# Altium schematic sheet INPUTS_OUTPUTS.SchDoc
size A4; SheetNumber: 2; SheetTotal: 4
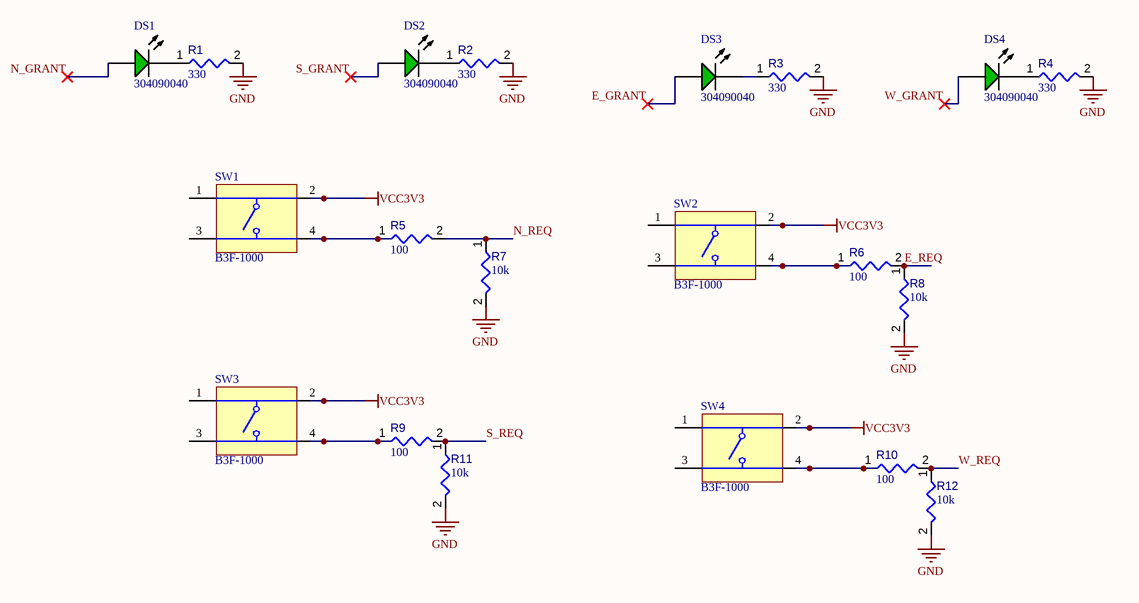
[diagram p0: INPUTS_OUTPUTS.SchDoc]

## Parts
DS1  304090040  [LED-2P-2.28-3MM]
DS2  304090040  [LED-2P-2.28-3MM]
DS3  304090040  [LED-2P-2.28-3MM]
DS4  304090040  [LED-2P-2.28-3MM]
R1  value 330  [RESC0402(1005)_L]  (hidden comment: Resistor 330R +/-5 % 0402 63 mW)
R2  value 330  [RESC0402(1005)_L]  (hidden comment: Resistor 330R +/-5 % 0402 63 mW)
R3  value 330  [RESC0402(1005)_L]  (hidden comment: Resistor 330R +/-5 % 0402 63 mW)
R4  value 330  [RESC0402(1005)_L]  (hidden comment: Resistor 330R +/-5 % 0402 63 mW)
R5  value 100  [RESC0402(1005)_L]  (hidden comment: 100R2F)
R6  value 100  [RESC0402(1005)_L]  (hidden comment: 100R2F)
R7  value 10k  [RESC0402(1005)_L]  (hidden comment: 10KR2F)
R8  value 10k  [RESC0402(1005)_L]  (hidden comment: 10KR2F)
R9  value 100  [RESC0402(1005)_L]  (hidden comment: 100R2F)
R10  value 100  [RESC0402(1005)_L]  (hidden comment: 100R2F)
R11  value 10k  [RESC0402(1005)_L]  (hidden comment: 10KR2F)
R12  value 10k  [RESC0402(1005)_L]  (hidden comment: 10KR2F)
SW1  B3F-1000  [OMRON-B3F-1000-4_V]
SW2  B3F-1000  [OMRON-B3F-1000-4_V]
SW3  B3F-1000  [OMRON-B3F-1000-4_V]
SW4  B3F-1000  [OMRON-B3F-1000-4_V]

## Nets
GND: R1.2 R2.2 R3.2 R4.2 R7.2 R8.2 R11.2 R12.2
VCC3V3: SW1.2 SW2.2 SW3.2 SW4.2
E_GRANT: DS3.1(A)
E_REQ: R6.2 R8.1
N_GRANT: DS1.1(A)
N_REQ: R5.2 R7.1
S_GRANT: DS2.1(A)
S_REQ: R9.2 R11.1
W_GRANT: DS4.1(A)
W_REQ: R10.2 R12.1
NetDS1_2: DS1.2(K) R1.1
NetDS2_2: DS2.2(K) R2.1
NetDS3_2: DS3.2(K) R3.1
NetDS4_2: DS4.2(K) R4.1
NetR5_1: R5.1 SW1.4
NetR6_1: R6.1 SW2.4
NetR9_1: R9.1 SW3.4
NetR10_1: R10.1 SW4.4

Not connected (* = marked no-connect by the designer): SW1 1 3; SW2 1 3; SW3 1 3; SW4 1 3

## Library data of the parts
DS1-DS4 = CMP-007-00006-2: Green LED, 80 mW, 20 mA, -25 to 85 degC, 2-Pin THD; Manufacturer: Shenzhen CGX; Manufacturer URL: http://szcgx.com/; Package Reference: 304090040; Datasheet Version: Rev. 1.0, 09/2014; RoHS Compliant: Unknown; Case/Package: 304090040; Package Description: 2-Pin Through Hole Device, Dia 3 mm, Pitch 2.28 mm; Datasheet URL: http://datasheet.octopart.com/304090040-Chengguangxing-datasheet-62330655.pdf; Mounting Technology: TH
R1-R4 = CMP-009-00132-3: Chip Resistor, 330 Ohms, +/-5 %, 63 mW, -55 to 155 degC, 0402; Power: 63mW; Tolerance: 5%; Pins: 2; Max Operating Temperature: 155°C; Min Operating Temperature: -55°C; Case/Package: 0402
R5 R6 R9 R10 = CMP-009-00065-2: 100R 0.063W 1% 0402 (1005 Metric)  SMD; Power: 63mW; Tolerance: 1%; Case/Package: 0402; Pins: 2; Mounting Technology: SMT
R7 R8 R11 R12 = CMP-009-00066-2: 10K 0.063W 1% 0402 (1005 Metric)  SMD; Power: 63mW; Case/Package: 0402; Mounting Technology: SMT; Pins: 2; Tolerance: 1%
SW1-SW4 = CMP-011-00004-2: Tactile Switch, SPST-NO, 0.05 A, 24 V, -25 to 70 degC, 4-Pin THD, RoHS, Bulk; Manufacturer: Omron Electronic Components; Throw Configuration: SPST; Max Contact Resistance: 100mohm; Resistance: 0.1Ohm; Max Current Rating: 50mA; Voltage Rating: 24V; Operating Force: 100gf; Datasheet Version: Jan-15; Case/Package: B3F-1000; Packaging: Bulk; Package Description: 4-Pin Through Hole Device, Body 6 x 6 mm; Manufacturer URL: http://www.omron.com/; Package Reference: B3F-1000; Contact Plating: Gold; Contact Current Rating: 50mA; RoHS Compliant: True; Contact Material: Gold; Mounting Technology: TH; Max Operating Temperature: 70°C; Min Operating Temperature: -25°C; Package Quantity: 1500; Datasheet URL: http://www.omron.com/ecb/products/pdf/en-b3f.pdf; Voltage Rating (DC): 24V; Pins: 4; Current Rating: 50mA; Max Voltage Rating (DC): 24V